# EasyEDA Pro project ProPrj_STC电磁2.0挖孔.epro, board PCB1
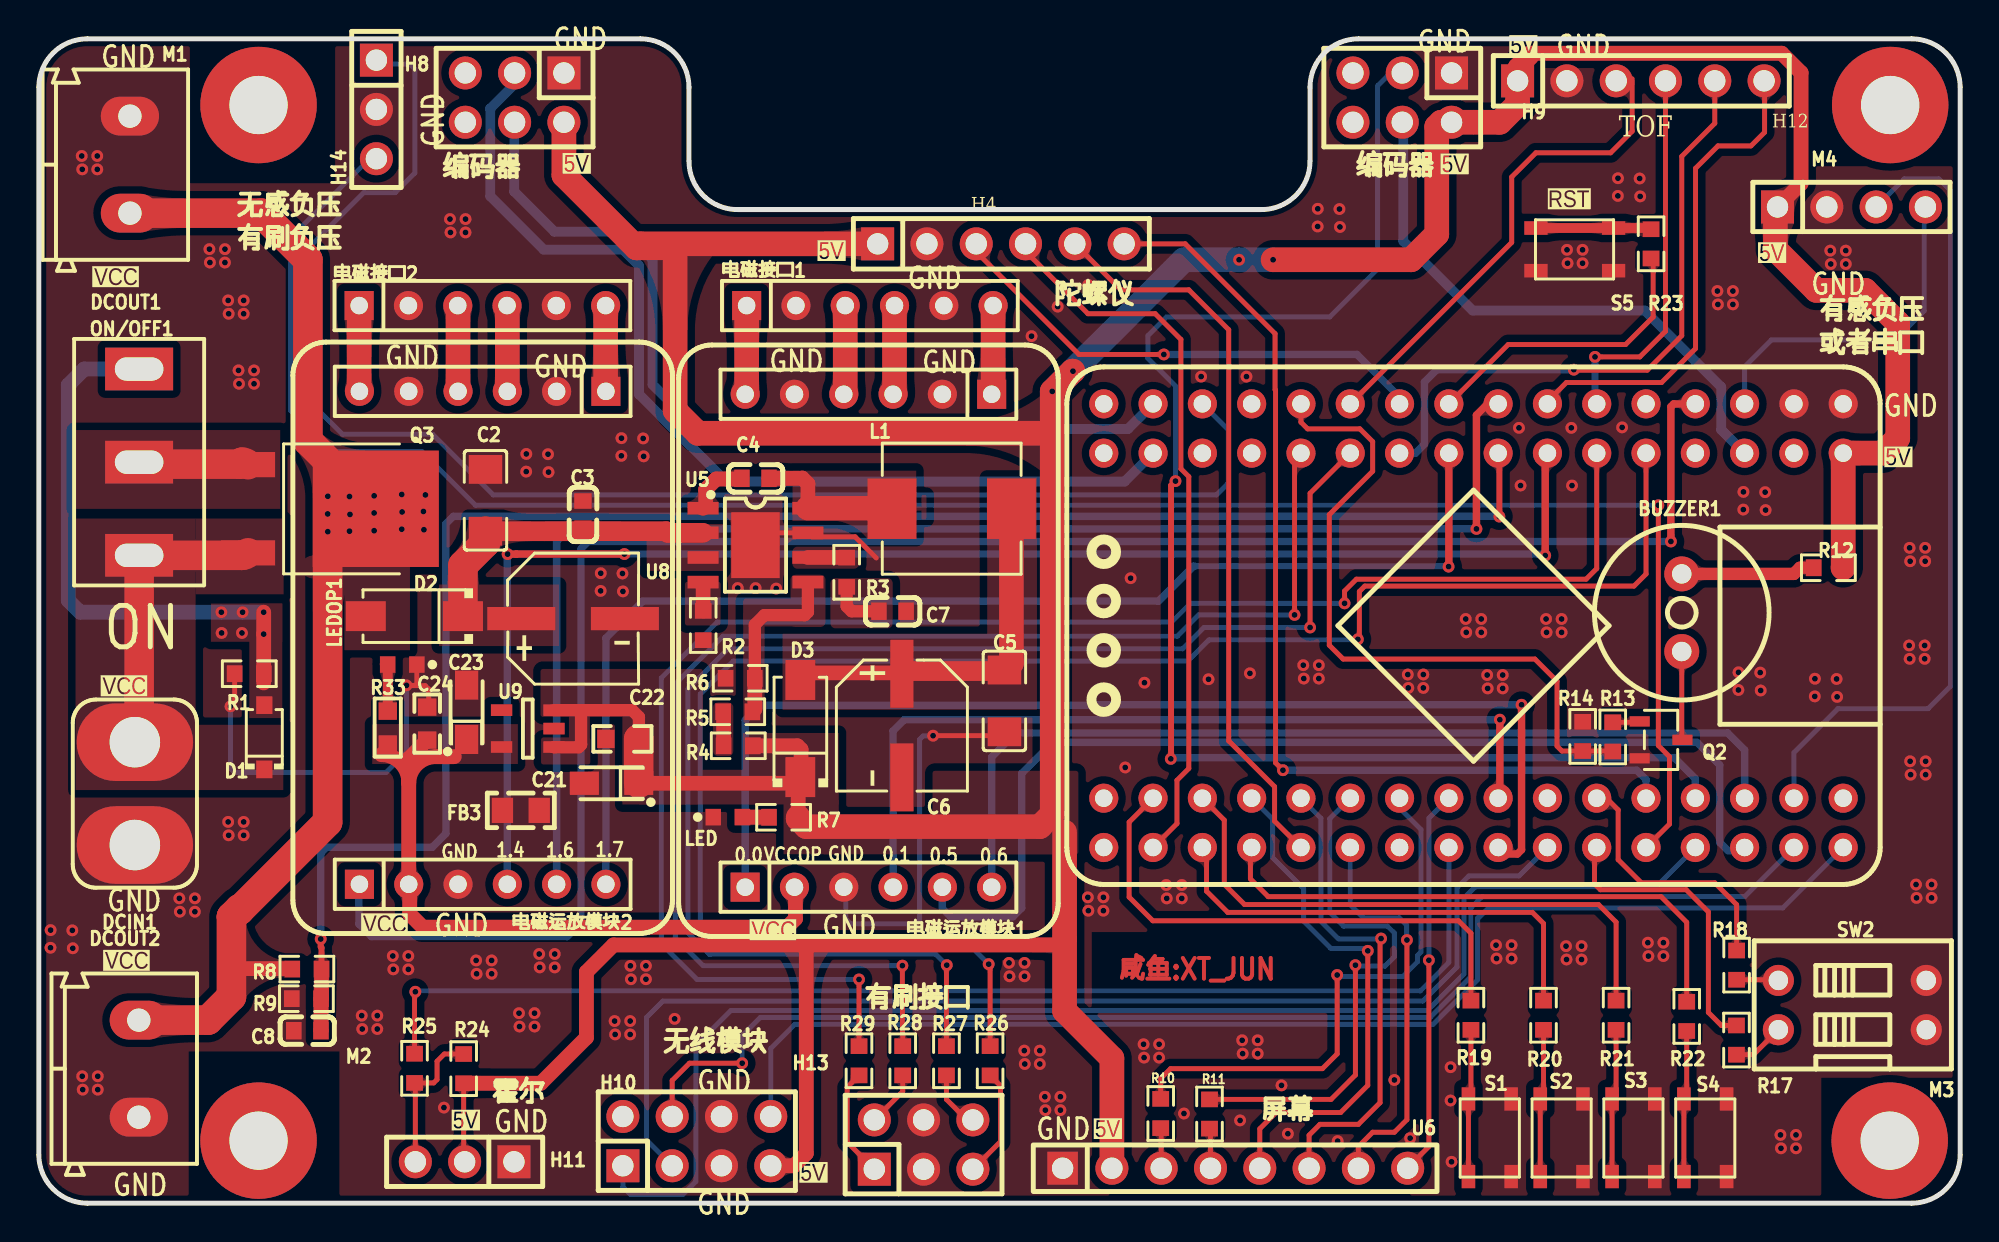
[diagram p2: board, top side]
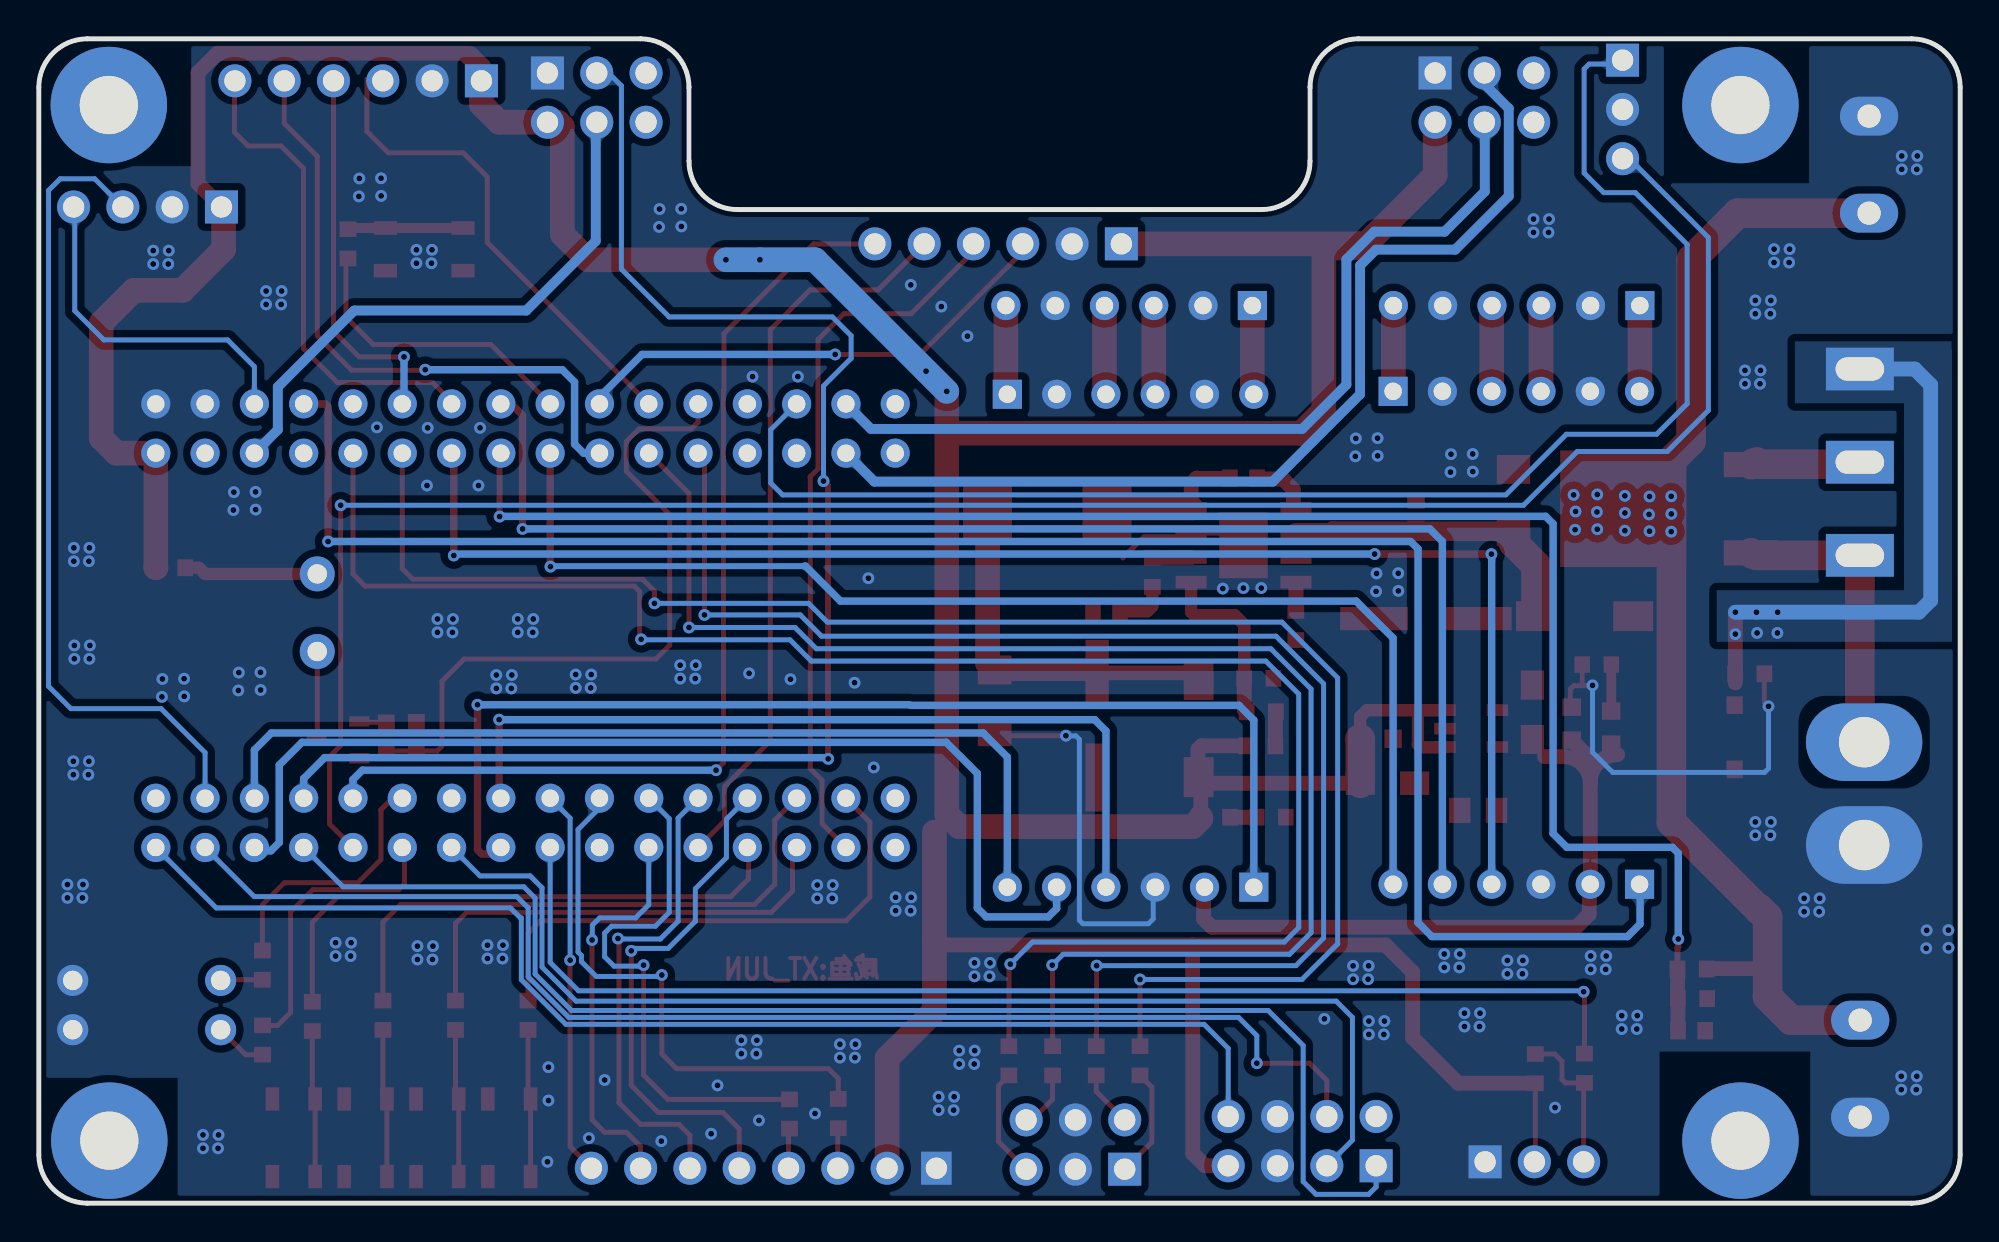
[diagram p3: board, bottom side, seen from below]

Outline 99 x 60 mm; copper layers: Top Layer, Bottom Layer. Coordinates in mm from the lower left corner of the outline.
Outline path: 0,57.5 0,2.5 arc(0.73,0.73) 2.5,0 96.5,0 arc(98.27,0.73) 99,2.5 99,57.5 arc(98.27,59.27) 96.5,60 68,60 arc(66.23,59.27) 65.5,57.5 65.5,53.7 arc(64.77,51.93) 63,51.2 36,51.2 arc(34.23,51.93) 33.5,53.7 33.5,57.5 arc(32.77,59.27) 31,60 2.5,60 arc(0.73,59.27) 0,57.5
Stack: Top Layer 0.012mm / Dielectric1 0.025mm FR4 er 4.5 / Bottom Layer 0.012mm

## Design rules (mm)
template: 自定义配置
spacing copperThickness1oz (default): track to track 0.102, other pairs 0.152 to 0.3
spacing copperThickness2oz: track to track 0.203, other pairs 0.152 to 0.3
track width copperThickness1oz (default): min 0.127, default 0.254, max 2.54
track width copperThickness2oz: min 0.203, default 0.254, max 2.54
differential pair differentialPair (default): width min 0.127, default 0.254, max 2.54; gap min 0.152, default 0.152
via viaSize (default): diameter min 0.5, default 0.61, max 10; hole min 0.3, default 0.305, max 6.3
net GND uses copperRegion1

## Placement (name value [footprint] x y rotation side)
BUZZER1  2.7kHz  [BUZ-TH_BD9.0-P4.00-D0.6-FD]  84.65 30.43 270 top
C2  4.7uF  [C1206]  23.01 36.22 270 top
C3  100nF  [C0603]  28.04 35.48 270 top
C4  100nF  [C0603]  36.93 37.35 180 top
C5  47uF  [C1206]  49.75 25.88 90 top
C6  100uF  [CAP-SMD_BD6.3-L6.6-W6.6-LS7.6-FD-1]  44.47 24.61 270 top
C7  4.7nF  [C0603]  43.99 30.5 180 top
C8  100nF  [C0603]  13.84 8.89 0 top
C21  10uF  [CAPT3216]  29.51 21.64 180 top
C22  100nF  [CAPC1608[0603]S-N]  30.07 23.93 0 top
C23  10uF  [CAPT3216]  22.04 25.3 90 top
C24  100nF  [CAPC1608[0603]S-N]  20.01 24.71 270 top
D1  BZT52C16  [SOD-123_L2.7-W1.7-LS3.8-RD]  11.62 24.01 90 top
D2  SS54  [SMA_L4.4-W2.8-LS5.4-R-RD]  19.35 30.25 180 top
D3  SS54  [SMA_L4.4-W2.8-LS5.4-R-RD]  39.24 24.46 90 top
DCIN1  T型插头  [Wired T-Header ThroughHole]  4.95 21.11 0 top
DCOUT1  KF/WJ/DG 30x connecter  [KF/WJ/DG 301-2p-5.0mm]  4.69 53.52 90 top
DCOUT2  KF/WJ/DG 30x connecter  [KF/WJ/DG 301-2p-5.0mm]  5.15 6.93 90 top
FB3  0R  [INDC2012[0805]S]  24.84 20.24 180 top
H4  PZ254V-11-06P  [HDR-TH_6P-P2.54-V-M]  49.57 49.44 0 top
H5  PZ254V-11-04P  [HDR-TH_4P-P2.54-V-M]  93.4 51.34 0 top
H8  PZ254V-12-6P  [HDR-TH_6P-P2.54-V-M-R2-C3-S2.54]  24.52 56.97 180 top
H9  PZ254V-12-6P  [HDR-TH_6P-P2.54-V-M-R2-C3-S2.54]  70.25 56.97 180 top
H10  PZ254V-12-8P  [HDR-TH_8P-P2.54-V-M-R2-C4-S2.54]  33.9 3.2 0 top
H11  PZ254V-11-03P  [HDR-TH_3P-P2.54-V-M]  21.94 2.13 180 top
H12  PZ254V-11-06P  [HDR-TH_6P-P2.54-V-M]  82.55 57.83 0 top
H13  PZ254V-12-6P  [HDR-TH_6P-P2.54-V-M-R2-C3-S2.54]  45.59 3.02 0 top
H14  PZ254V-11-03P  [HDR-TH_3P-P2.54-V-M]  17.39 56.36 270 top
L1  4.7uH  [IND-SMD_L7.3-W6.6_MHCI06030]  47.04 35.79 0 top
LED  LED  [LEDC1608(0603)]  35.5 19.89 0 top
LEDOP1  LEDOP  [LEDC1608(0603)]  18.73 27.75 180 top
M1  MountHole  [M3-MountHole-Plated-D6]  11.32 56.59 0 top
M2  MountHole  [M3-MountHole-Plated-D6]  11.32 3.22 0 top
M3  MountHole  [M3-MountHole-Plated-D6]  95.37 3.22 0 top
M4  MountHole  [M3-MountHole-Plated-D6]  95.39 56.59 0 top
ON/OFF1  SW-SPDT  [SS12D10]  5.17 38.18 90 top
Q2  S8050 J3Y  [SOT-23-3_L3.0-W1.7-P0.95-LS2.9-BR]  83.59 23.87 180 top
Q3  HY19P03D  [TO-252-2_L6.6-W6.1-P4.57-LS9.9-TL-CW]  14.07 35.78 0 top
R1  10kΩ  [R0603]  10.84 27.28 0 top
R2  200kΩ  [R0603]  34.24 29.77 90 top
R3  20kΩ  [R0603]  41.63 32.51 90 top
R4  51kΩ  [R0603]  36.04 23.57 0 top
R5  1.5kΩ  [R0603]  36.01 25.32 180 top
R6  10kΩ  [R0603]  36.14 27.05 0 top
R7  4.7kΩ  [R0603]  38.38 19.89 0 top
R8  200kΩ  [R0603]  13.81 12.06 180 top
R9  20kΩ  [R0603]  13.79 10.54 180 top
R10  100Ω  [R0603]  57.81 4.62 90 top
R11  100Ω  [R0603]  60.32 4.6 90 top
R12  10Ω  [R0603]  92.21 32.74 180 top
R13  4.7kΩ  [R0603]  81.1 24.03 90 top
R14  10kΩ  [R0603]  79.55 24.05 90 top
R17  100Ω  [R0603]  87.47 8.41 270 top
R18  100Ω  [R0603]  87.48 12.27 270 top
R19  100Ω  [R0603]  73.79 9.68 270 top
R20  100Ω  [R0603]  77.53 9.68 270 top
R21  100Ω  [R0603]  81.27 9.68 270 top
R22  100Ω  [R0603]  84.91 9.63 270 top
R23  100Ω  [R0603]  83.07 49.44 90 top
R24  10kΩ  [R0603]  21.89 6.93 270 top
R25  100Ω  [R0603]  19.36 6.95 270 top
R26  100Ω  [R0603]  49.02 7.34 90 top
R27  100Ω  [R0603]  46.77 7.34 270 top
R28  100Ω  [R0603]  44.51 7.34 270 top
R29  100Ω  [R0603]  42.26 7.34 270 top
R33  4.7K  [RESC1608[0603]S-N]  17.98 24.51 270 top
S1  Button  [PTS810-3*4-CurvePin]  74.76 3.37 90 top
S2  Button  [PTS810-3*4-CurvePin]  78.46 3.37 90 top
S3  Button  [PTS810-3*4-CurvePin]  82.16 3.37 90 top
S4  Button  [PTS810-3*4-CurvePin]  85.86 3.37 90 top
S5  Button  [PTS810-3*4-CurvePin]  79.14 49.15 0 top
SW2  DS-02RP  [SW-TH_DS-02XP]  93.44 10.21 90 top
U1  -  [STC32]  73.92 29.76 270 top
U5  -  [SP1N28STER]  36.93 33.91 0 top
U6  PM254-1-08-Z-8.5  [HDR-TH_8P-P2.54-V-F]  61.64 1.8 0 top
U8  100uF  [CAP-SMD_BD6.3-L6.6-W6.6-LS7.6-RD]  27.53 30.12 0 top
U9  RT9013-33  [SOT-23-5]  25.2 24.46 180 top
电磁接口1  Header 6  [HDR1X6]  36.47 46.25 0 top
电磁接口2  Header 6  [HDR1X6]  16.51 46.25 0 top
电磁运放模块1  OPA_MOD  [SEEKFREE_4CHANEL_OPAMOD]  42.75 28.98 0 top
电磁运放模块2  OPA_MOD  [SEEKFREE_4CHANEL_OPAMOD]  22.87 29.13 0 top

## Footprints (pads in the part's own frame, mm; a bottom-side part is the same pattern mirrored in y, then rotated)
BUZ-TH_BD9.0-P4.00-D0.6-FD
  round 1.8 hole 1: 1(-2,0) 2(2,0)
C0603
  rect 0.8x0.9 smd: 1(-0.7,0) 2(0.7,0)
C1206
  rect 1.485x1.728 smd: 1(-1.593,0) 2(1.593,0)
CAP-SMD_BD6.3-L6.6-W6.6-LS7.6-FD-1
  rect 3.5x1.2 smd: 1(-2.67,0) 2(2.67,0)
CAP-SMD_BD6.3-L6.6-W6.6-LS7.6-RD
  rect 3.5x1.2 smd: 1(-2.67,0) 2(2.67,0)
CAPC1608[0603]S-N
  rect 0.9x0.95 smd: 1(-0.85,0) 2(0.85,0)
CAPT3216
  rect 1.5x1.2 smd: 1(-1.4,0) 2(1.4,0)
HDR1X6
  rect 1.5x1.5 hole 0.9: 1(0,0)
  round 1.5 hole 0.9: 2(2.54,0) 3(5.08,0) 4(7.62,0) 5(10.16,0) 6(12.7,0)
HDR-TH_3P-P2.54-V-M
  rect 1.7x1.7 hole 1.1: 1(-2.54,0)
  round 1.7 hole 1.1: 2(0,0) 3(2.54,0)
HDR-TH_4P-P2.54-V-M
  rect 1.7x1.7 hole 1.1: 1(-3.81,0)
  round 1.7 hole 1.1: 2(-1.27,0) 3(1.27,0) 4(3.81,0)
HDR-TH_6P-P2.54-V-M
  rect 1.7x1.7 hole 1.1: 1(-6.35,0)
  round 1.7 hole 1.1: 2(-3.81,0) 3(-1.27,0) 4(1.27,0) 5(3.81,0) 6(6.35,0)
HDR-TH_6P-P2.54-V-M-R2-C3-S2.54
  rect 1.7x1.7 hole 1.1: 1(-2.54,-1.27)
  round 1.7 hole 1.1: 2(-2.54,1.27) 3(0,-1.27) 4(0,1.27) 5(2.54,-1.27) 6(2.54,1.27)
HDR-TH_8P-P2.54-V-F
  rect 1.575x1.7 hole 1.1: 1(-8.89,0)
  round 1.7 hole 1.1: 2(-6.35,0) 3(-3.81,0) 4(-1.27,0) 5(1.27,0) 6(3.81,0) 7(6.35,0) 8(8.89,0)
HDR-TH_8P-P2.54-V-M-R2-C4-S2.54
  rect 1.7x1.7 hole 1.1: 1(-3.81,-1.27)
  round 1.7 hole 1.1: 2(-3.81,1.27) 3(-1.27,-1.27) 4(-1.27,1.27) 5(1.27,-1.27) 6(1.27,1.27) 7(3.81,-1.27) 8(3.81,1.27)
IND-SMD_L7.3-W6.6_MHCI06030
  rect 2.524x3.12 smd: 1(-3.078,0) 2(3.078,0)
INDC2012[0805]S
  rect 1.1x1.3 smd: 1(-0.948,0) 2(0.948,0)
KF/WJ/DG 301-2p-5.0mm
  oval 2x3 hole 1.2: 1(2.5,0) 2(-2.5,0)
LEDC1608(0603)
  rect 0.8x0.85 smd: A(0.75,0) C(-0.75,0)
M3-MountHole-Plated-D6
  round 6 hole 3: 1(0,0)
PTS810-3*4-CurvePin
  rect 1.2x0.7 smd: 1(-2,-1.1) 1(2,-1.1) 2(-2,1.1) 2(2,1.1)
R0603
  rect 0.806x0.864 smd: 1(-0.753,0) 2(0.753,0)
RESC1608[0603]S-N
  rect 0.9x0.95 smd: 1(-0.85,0) 2(0.85,0)
SEEKFREE_4CHANEL_OPAMOD
  rect 1.5x1.5 hole 0.9: 1(6.35,12.7) 7(-6.35,-12.7)
  round 1.5 hole 0.9: 2(3.81,12.7) 3(1.27,12.7) 4(-1.27,12.7) 5(-3.81,12.7) 6(-6.35,12.7) 8(-3.81,-12.7) 9(-1.27,-12.7) 10(1.27,-12.7) 11(3.81,-12.7) 12(6.35,-12.7)
SMA_L4.4-W2.8-LS5.4-R-RD
  rect 2.062x1.539 smd: 1(2.503,0) 2(-2.503,0)
SOD-123_L2.7-W1.7-LS3.8-RD
  rect 0.91x0.84 smd: 1(-1.655,0) 2(1.655,0)
SOT-23-3_L3.0-W1.7-P0.95-LS2.9-BR
  rect 1.038x0.532 smd: 1(1.101,-0.95) 2(1.101,0.95) 3(-1.101,0)
SOT-23-5
  rect 1.1x0.6 smd: 1(-1.35,0.95) 2(-1.35,0) 3(-1.35,-0.95) 4(1.35,-0.95) 5(1.35,0.95)
SP1N28STER
  rect 2.5x3.4 smd: 0(0,0)
  rect 1.6x0.65 smd: 1(-2.7,1.905) 2(-2.7,0.635) 3(-2.7,-0.635) 4(-2.7,-1.905) 5(2.7,-1.905) 6(2.7,-0.635) 7(2.7,0.635) 8(2.7,1.905)
SS12D10
  rect 2.2x3.5 hole 1.2x2.5: 1(-4.8,0) 2(0,0) 3(4.8,0)
STC32
  round 1.5 hole 0.9: 1(-11.43,19.05) 2(-8.89,19.05) 3(-11.43,16.51) 4(-8.89,16.51) 5(-11.43,13.97) 6(-8.89,13.97) 7(-11.43,11.43) 8(-8.89,11.43) 9(-11.43,8.89) 10(-8.89,8.89) 11(-11.43,6.35) 12(-8.89,6.35) 13(-11.43,3.81) 14(-8.89,3.81) 15(-11.43,1.27) 16(-8.89,1.27) 17(-11.43,-1.27) 18(-8.89,-1.27) 19(-11.43,-3.81) 20(-8.89,-3.81) 21(-11.43,-6.35) 22(-8.89,-6.35) 23(-11.43,-8.89) 24(-8.89,-8.89) 25(-11.43,-11.43) 26(-8.89,-11.43) 27(-11.43,-13.97) 28(-8.89,-13.97) 29(-11.43,-16.51) 30(-8.89,-16.51) 31(-11.43,-19.05) 32(-8.89,-19.05) 33(8.89,-19.05) 34(11.43,-19.05) 35(8.89,-16.51) 36(11.43,-16.51) 37(8.89,-13.97) 38(11.43,-13.97) 39(8.89,-11.43) 40(11.43,-11.43) 41(8.89,-8.89) 42(11.43,-8.89) 43(8.89,-6.35) 44(11.43,-6.35) 45(8.89,-3.81) 46(11.43,-3.81) 47(8.89,-1.27) 48(11.43,-1.27) 49(8.89,1.27) 50(11.43,1.27) 51(8.89,3.81) 52(11.43,3.81) 53(8.89,6.35) 54(11.43,6.35) 55(8.89,8.89) 56(11.43,8.89) 57(8.89,11.43) 58(11.43,11.43) 59(8.89,13.97) 60(11.43,13.97) 61(8.89,16.51) 62(11.43,16.51) 63(8.89,19.05) 64(11.43,19.05)
SW-TH_DS-02XP
  round 1.6 hole 1: 1(-1.27,3.81) 2(1.27,3.81) 3(1.27,-3.81) 4(-1.27,-3.81)
TO-252-2_L6.6-W6.1-P4.57-LS9.9-TL-CW
  rect 2.8x1.3 smd: 1(-3.292,2.273) 3(-3.292,-2.273)
  rect 6.5x6 smd: 2(3.292,0)
Wired T-Header ThroughHole
  rrect 6x4 hole 2.6: 1(0,2.65) 2(0,-2.65)

## Nets
As in the schematic.

Pads without a net: H8 5 6; H9 5 6; H10 2; M1 1; M2 1; M3 1; M4 1; U1 4 8 9 25 26 28 31 32 46 63; U9 4

## Via types
v1: diameter 0.61, hole 0.305, Top Layer to Bottom Layer, 279 vias

## Routing (per net, layer and track width the routed paths; a pad name or vN(x,y) marks a point on that pad's centre or on a via; arc(x,y) is an arc through that point)
GND: length 48.3
  Top Layer w0.254: 43.15,33.25 42.06,34.34 39.83,34.34 U5.7 37.56,34.54 U5.0 ; LEDOP1.C 19.48,26.68 v1(18.94,26.68) 18.96,26.67 19.91,26.67 20.09,26.49 20.09,25.64 C24.1 ; v1(9.88,25.6) 10.09,25.82 R1.1 ; v1(46.08,24.09) 49.56,24.09 C5.1
  Bottom Layer w0.254: v1(18.94,26.68) 18.94,23.24 17.9,22.2 10.08,22.2 9.88,22.4 v1(9.88,25.6) ; v1(46.08,24.09) 46.06,24.08 45.56,24.08 45.38,23.9 45.38,14.58 45.2,14.4 41.83,14.4 41.58,14.65 41.58,16.18 电磁运放模块1.9
  vias: v1(0.61,14.07) v1(0.6,13.16) v1(1.73,14.06) v1(1.75,13.14) v1(2.21,53.96) v1(2.24,53.27) v1(2.24,6.54) v1(2.26,5.85) v1(3.01,53.96) v1(3.01,53.27) v1(3.04,6.54) v1(3.04,5.85) v1(7.24,15.71) v1(7.27,15.02) v1(8.04,15.71) v1(8.04,15.02) v1(8.79,49.16) v1(8.82,48.47) v1(9.59,49.16) v1(9.59,48.47) v1(9.76,46.52) v1(9.78,45.83) v1(9.76,19.65) v1(9.78,18.96) v1(10.29,42.91) v1(10.32,42.22) v1(10.56,46.52) v1(10.56,45.83) v1(10.56,19.65) v1(10.56,18.96) v1(11.09,42.91) v1(11.09,42.22) v1(16.64,9.67) v1(16.67,8.98) v1(17.44,9.67) v1(17.44,8.98) v1(18.24,12.74) v1(18.27,12.05) v1(19.04,12.74) v1(19.04,12.05) v1(20.87,4.93) v1(21.19,50.71) v1(21.21,50.02) v1(21.99,50.71) v1(21.99,50.02) v1(22.53,12.51) v1(22.56,11.82) v1(23.33,12.51) v1(23.33,11.82) v1(24.74,9.79) v1(24.77,9.1) v1(25.12,38.61) v1(25.11,37.7) v1(25.54,9.79) v1(25.54,9.1) v1(25.78,12.84) v1(25.81,12.15) v1(26.24,38.6) v1(26.26,37.67) v1(26.58,12.84) v1(26.58,12.15) v1(28.95,32.46) v1(28.95,31.55) v1(29.67,9.39) v1(29.69,8.7) v1(30.02,39.42) v1(30.02,38.51) v1(30.07,32.45) v1(30.1,31.53) v1(30.48,12.23) v1(30.51,11.54) v1(30.47,9.39) v1(30.47,8.7) v1(31.14,39.41) v1(31.16,38.49) v1(31.28,12.23) v1(31.28,11.54) v1(32.76,9.5) v1(36.01,31.7) v1(36.93,31.7) v1(37.99,31.67) v1(49.99,12.38) v1(50.02,11.69) v1(50.79,12.38) v1(50.79,11.69) v1(50.78,7.86) v1(50.8,7.17) v1(51.15,44.68) v1(51.58,7.86) v1(51.58,7.17) v1(51.84,5.48) v1(51.86,4.8) v1(52.5,46.2) v1(52.64,5.48) v1(52.64,4.8) v1(54.07,47.32) v1(54.05,15.76) v1(54.08,15.07) v1(54.85,15.76) v1(54.85,15.07) v1(55.98,22.45) v1(56.26,32.21) v1(56.92,8.19) v1(56.97,26.82) v1(56.95,7.5) v1(57.72,8.19) v1(57.72,7.5) v1(58.09,16.4) v1(58.12,15.71) v1(58.89,16.4) v1(58.89,15.71) v1(59,4.62) v1(59.89,42.59) v1(60.27,27) v1(61.9,4.27) v1(62,8.4) v1(62.03,7.71) v1(62.23,42.59) v1(62.4,27.3) v1(62.8,8.4) v1(62.8,7.71) v1(64.03,6.07) v1(64.36,3.58) v1(65.15,27.72) v1(65.18,27.04) v1(65.9,51.24) v1(65.89,50.33) v1(65.95,27.72) v1(65.95,27.04) v1(66.92,3.2) v1(67.02,51.23) v1(67.04,50.31) v1(69.85,6.35) v1(70.54,27.24) v1(70.56,26.55) v1(70.66,3.35) v1(71.34,27.24) v1(71.34,26.55) v1(72.74,7.01) v1(72.74,5.29) v1(72.79,2.13) v1(73.52,30.1) v1(73.55,29.41) v1(74.32,30.1) v1(74.32,29.41) v1(74.63,27.22) v1(74.65,26.53) v1(75.08,13.3) v1(75.11,12.61) v1(75.43,27.22) v1(75.43,26.53) v1(75.88,13.3) v1(75.88,12.61) v1(76.27,39.95) v1(76.35,36.98) v1(77.66,30.1) v1(77.69,29.41) v1(78.46,30.1) v1(78.46,29.41) v1(78.74,49.13) v1(78.69,13.25) v1(78.72,12.56) v1(78.77,48.44) v1(78.96,39.95) v1(79,36.98) v1(79.54,49.13) v1(79.54,48.44) v1(79.49,13.25) v1(79.49,12.56) v1(81.37,52.82) v1(81.36,51.91) v1(81.58,39.98) v1(82.49,52.8) v1(82.51,51.88) v1(82.91,13.42) v1(82.93,12.73) v1(83.71,13.42) v1(83.71,12.73) v1(86.49,47) v1(86.52,46.31) v1(87.29,47) v1(87.29,46.31) v1(87.58,27.36) v1(87.57,26.45) v1(87.83,36.65) v1(87.83,35.74) v1(88.7,27.34) v1(88.72,26.42) v1(88.95,36.64) v1(88.97,35.72) v1(89.74,3.52) v1(89.77,2.83) v1(90.54,3.52) v1(90.54,2.83) v1(91.52,27.03) v1(91.51,26.12) v1(92.31,49.09) v1(92.33,48.4) v1(92.63,27.01) v1(92.66,26.09) v1(93.11,49.09) v1(93.11,48.4) v1(96.39,33.77) v1(96.42,33.08) v1(96.37,28.74) v1(96.4,28.05) v1(96.42,22.77) v1(96.45,22.08) v1(96.72,16.42) v1(96.75,15.73) v1(97.2,33.77) v1(97.2,33.08) v1(97.17,28.74) v1(97.17,28.05) v1(97.22,22.77) v1(97.22,22.08) v1(97.53,16.42) v1(97.53,15.73)
VBAT: length 61.3
  Top Layer w0.762: R8.2 13.03,12.09 10.44,12.09
  Top Layer w1.524: DCOUT1.2 11.46,51.02 13.86,48.61 13.86,39.28 Q3.2 14.88,33.3 14.88,19.64 10.34,15.1 ; 10.34,15.1 10.34,15.17 9.93,14.76 ; 10.34,15.1 9.93,14.76 ; 9.93,14.76 9.93,10.64 8.72,9.43 DCOUT2.1
  vias: v1(14.89,36.43) v1(14.88,35.52) v1(14.89,34.6) v1(16.01,36.41) v1(16.03,35.49) v1(16.01,34.63) v1(17.28,36.45) v1(17.28,35.57) v1(17.28,34.65) v1(18.7,36.52) v1(18.72,35.62) v1(18.7,34.73) v1(19.82,35.64) v1(19.84,34.7) v1(19.92,36.5)
VCC5V: length 267
  Top Layer w0.254: H11.2 21.89,2.18 R24.2
  Top Layer w0.635: 27.94,25.41 30.57,25.41 30.92,25.06 C22.2 ; 27.94,25.41 U9.3 ; 27.94,25.41 27.94,23.63 27.81,23.49 26.56,23.49 U9.1
  Top Layer w0.762: 39.54,13.31 52.55,13.31 52.85,13.61 ; 39.54,13.31 29.61,13.31 28.22,11.91 28.22,8.53 25.86,6.18 R24.2 ; 39.54,13.31 39.54,2.56 38.91,1.93 H10.7 ; R4.2 39.09,23.57 39.28,23.38 39.28,21.92 ; 76.81,59.13 76.93,59.26 89.8,59.26 90.8,58.25 90.8,52.55 H5.1 ; R7.2 39.13,21.84 ; 38.92,21.64 C21.1
  Top Layer w1.016: 76.81,59.13 76.2,58.52 H12.1
  Top Layer w1.27: H8.2 27.06,52.97 30.8,49.23 ; H4.1 31,49.44 30.8,49.23 ; R7.2 39.13,19.82 39.54,19.4 51.58,19.4 52.22,20.04 v1(52.22,41.83) 53.26,42.87 v1(53.28,42.87) ; 52.85,19.12 52.85,9.9 55.29,7.47 U6.2 ; H12.1 76.2,56.62 75.28,55.7 72.26,55.7 72.03,55.47 72.03,49.93 70.71,48.61 v1(63.6,48.61) ; H5.1 89.48,51.23 89.48,49.15 91.59,47.04 94.1,47.04 95.78,45.36 95.78,39.42 95.01,38.65 U1.2 92.97,32.76 R12.1 ; 30.8,49.23 32.79,49.23 32.79,40.84 33.96,39.67 51.96,39.67
  Top Layer w1.524: C21.1 30.91,23.92 C22.2
  Bottom Layer w1.27: v1(52.22,41.83) 59,48.61 v1(61.84,48.61) v1(63.6,48.61)
VCCOP: length 36.6
  Top Layer w0.762: 电磁运放模块1.8 38.99,16.23 38.99,14.66 38.55,14.22 19.78,14.22 19.11,14.89 19.11,16.38 电磁运放模块2.8 19.06,21.62 arc(19.47,22.6) 20.45,23.01 21.41,23.01 ; C24.2 19.06,22.91 19.06,21.7 arc(18.65,22.7) 17.65,23.11
0.0: length 57.8
  Top Layer w0.381: v1(76.4,25.68) 76.4,18.21 76.18,17.99 75.53,17.99 U1.50
  Bottom Layer w0.381: 电磁运放模块1.7 36.4,24.89 37.16,25.65 54.08,25.65 ; 54.16,25.68 v1(76.4,25.68)
0.1: length 43.6
  Top Layer w0.381: v1(75.28,24.92) 75.28,20.96 U1.49
  Bottom Layer w0.381: 电磁运放模块1.10 44.02,24.33 44.6,24.92 v1(75.28,24.92)
0.2: length 60.6
  Bottom Layer w0.254: U1.52 76.27,16.86 73.68,16.86 73.07,16.25 73.07,12.17 71.32,10.41 32.15,10.41 31.31,9.57 31.31,3.25 H10.3
0.3: length 70.3
  Bottom Layer w0.254: U1.58 83.33,16.31 74.01,16.31 73.43,15.72 73.43,11.81 71.55,9.93 35.66,9.93 33.85,8.13 33.85,1.12 33.19,0.46 30.48,0.46 30.09,0.84 H10.1
0.4: length 74.7
  Top Layer w0.305: v1(58.57,37.21) 58.34,36.98 58.34,22.91 v1(58.33,22.9)
  Bottom Layer w0.254: v1(58.57,37.21) 58.57,42.11 57.15,43.53 57.15,44.7 58.11,45.67 66.52,45.67 68.98,48.13 68.98,57.58 69.64,58.24 69.72,58.24
  Bottom Layer w0.381: v1(58.33,22.9) 58.39,22.96 84.27,22.96 85.35,21.88 U1.57
0.5: length 55.1
  Bottom Layer w0.381: 电磁运放模块1.11 46.56,15.19 46.99,14.76 50.19,14.76 50.64,15.21 50.64,22.15 52.24,23.75 85.44,23.75 86.61,22.58 86.61,18.59 87.04,18.16 87.72,18.16 U1.60
0.6: length 48.9
  Bottom Layer w0.381: U1.59 87.89,23.35 87.02,24.23 50.34,24.23 49.1,22.99 电磁运放模块1.12
0.7: length 67.6
  Top Layer w0.254: v1(36.24,7.21) 33.53,7.21 32.63,6.32 H10.4
  Bottom Layer w0.254: v1(36.24,7.21) 36.24,8.63 37.18,9.57 71.69,9.57 73.78,11.66 73.78,15.24 73.81,15.24 74.37,15.8 87.9,15.8 U1.62
1.0: length 42.1
  Bottom Layer w0.254: H5.3 96.12,52.79 97.9,52.79 98.5,52.19 98.5,26.63 97.35,25.48 92.7,25.48 90.43,23.22 U1.61
1.1: length 17.9
  Bottom Layer w0.254: 97.43,51.34 97.4,51.34 97.15,51.08 97.15,45.98 95.65,44.48 89.27,44.48 87.89,43.1 U1.5
1.3: length 97.9
  Top Layer w0.381: v1(84.09,34.1) 84.09,41.04 84.23,41.18 85.35,41.18 U1.7
  Bottom Layer w0.381: v1(84.09,34.1) 28.32,34.1 27.94,33.72 27.94,14.46 27.22,13.74 17.14,13.74 16.49,14.38 16.49,16.41 电磁运放模块2.7
1.4: length 75.8
  Top Layer w0.381: U1.14 77.62,38.53 v1(77.62,33.37) ; v1(24.16,33.45) 24.6,33.45 24.61,33.45 v1(30.17,33.45)
  Bottom Layer w0.381: v1(24.16,33.45) 24.14,33.43 电磁运放模块2.10 ; v1(77.62,33.37) 77.54,33.45 v1(30.17,33.45)
1.5: length 89.7
  Top Layer w0.305: R8.1 14.57,13.16 14.52,13.21 v1(14.52,13.61) ; U1.16 75.26,38.59 v1(75.26,35.38)
  Top Layer w0.762: R8.1 14.57,10.56 R9.1 14.54,8.89 C8.2
  Bottom Layer w0.381: v1(75.26,35.38) 75.24,35.39 21.36,35.39 20.98,35.01 20.98,19.05 20.27,18.34 14.83,18.34 14.52,18.03 v1(14.52,13.61)
1.6: length 72.5
  Top Layer w0.381: v1(74.08,34.74) 74.08,40.61 74.65,41.19 U1.15
  Bottom Layer w0.381: 74.07,34.75 27.33,34.75 26.68,34.1 电磁运放模块2.11
1.7: length 63.5
  Top Layer w0.381: U1.18 72.65,32.82 v1(72.64,32.8)
  Bottom Layer w0.305: v1(72.64,32.8) 72.62,32.83 59.55,32.83
  Bottom Layer w0.381: 电磁运放模块2.12 29.22,29.12 31.12,31.03 57.69,31.03 59.49,32.83 59.55,32.83
2.0: length 26.8
  Top Layer w0.254: U6.5 62.91,3.83 63.75,4.67 67.08,4.67 68.48,6.07 v1(68.48,13)
  Bottom Layer w0.254: v1(68.48,13) 68.35,13.13 66.57,13.13 65.17,14.53 65.17,16.2 63.57,17.8 63.57,19.79 U1.39
2.1: length 24.8
  Top Layer w0.254: U6.6 65.45,3.5 66.01,4.06 67.99,4.06 69.11,5.18 69.11,13.59 v1(69.16,13.64)
  Bottom Layer w0.254: U1.41 66.06,19.84 66.06,14.53 66.98,13.61 69.13,13.61 v1(69.16,13.64)
2.2: length 20.5
  Top Layer w0.254: v1(70.49,13.56) 70.49,4.3 69.85,3.66 68.73,3.66 67.99,2.92 U6.7
  Bottom Layer w0.254: U1.44 67.57,15.38 68.25,14.71 70.1,14.71 70.48,14.32 70.48,13.58 v1(70.49,13.56)
2.3: length 27.2
  Top Layer w0.254: v1(67.84,12.27) 67.84,6.6 66.59,5.35 R11.2
  Bottom Layer w0.254: U1.43 66.52,19.81 66.52,14.98 67.23,14.27 69.49,14.27 69.85,13.92 69.85,12.7 69.36,12.22 67.89,12.22 v1(67.84,12.27)
2.5: length 28.2
  Top Layer w0.254: v1(66.9,11.76) 66.9,7.69 66.14,6.93 58.31,6.93 57.81,6.42 R10.2
  Bottom Layer w0.254: v1(66.9,11.76) 66.98,11.68 70.28,11.68 71.04,12.44 71.04,12.76 71.22,12.94 71.22,19.26 70.11,20.36 U1.45
2.6: length 63
  Top Layer w0.254: R25.1 19.36,10.85 v1(19.4,10.9)
  Bottom Layer w0.254: U1.48 72.65,12.41 71.19,10.95 19.45,10.95 v1(19.4,10.9)
2.7: length 19.9
  Top Layer w0.254: U6.8 70.53,1.83 71.62,2.92 v1(71.62,12.52)
  Bottom Layer w0.254: U1.47 71.62,19.84 v1(71.62,12.52)
3.3: length 76.6
  Bottom Layer w0.254: H14.1 17.6,58.7 19.12,58.7 19.38,58.44 19.38,53.08 18.36,52.07 16.74,52.07 14.07,49.4 14.07,41.2 15.64,39.62 20.29,39.62 23.41,36.5 60.68,36.5 61.29,37.11 61.29,39.86 U1.27
3.4: length 51.8
  Bottom Layer w0.508: U1.30 55.95,37.18 35.42,37.18 30.92,41.68 30.92,48.32 30.11,49.14 26.02,49.14 23.26,51.89 23.26,56.41 25.09,58.24
3.5: length 46.1
  Bottom Layer w0.508: 25.09,55.7 24.5,55.11 24.5,52.13 26.56,50.06 30.19,50.06 31.62,48.63 31.62,42.18 33.91,39.9 56.12,39.9 U1.29
4.0: length 25.7
  Top Layer w0.254: H4.3 48.3,49.03 53.59,43.74 v1(57.97,43.74)
  Bottom Layer w0.381: v1(57.97,43.74) 67.92,43.74 70.11,41.54 U1.19
4.1: length 37.4
  Top Layer w0.254: U1.36 58.64,19.56 58.64,21.79 59.25,22.4 59.25,37.44 58.85,37.84 58.85,44.51 57.52,45.83 54.06,45.83 50.84,49.05 H4.4
4.2: length 38
  Top Layer w0.254: U1.42 63.67,19.69 63.67,21.46 61.31,23.82 61.31,45.01 59.25,47.06 55.75,47.06 H4.5
4.3: length 52.2
  Top Layer w0.254: v1(64.11,22.31) 63.72,22.69 63.72,41.89 63.7,41.92 63.7,44.8 59.07,49.44 H4.6
  Bottom Layer w0.381: v1(64.11,22.31) 82.33,22.31 82.81,21.83 U1.55
4.4: length 25.2
  Top Layer w0.254: H12.6 88.92,57.81 88.92,55.18 88.22,54.48 86.52,54.48 85.37,53.33 85.37,44.04 83.61,42.29 78.71,42.29 77.73,41.31 U1.13
4.5: length 64.9
  Bottom Layer w0.254: U1.64 89.86,15.21 74.7,15.21 74.19,14.71 74.14,14.71 74.14,11.52 71.84,9.22 38.96,9.22 37.71,7.97 H10.8
4.7: length 32.8
  Top Layer w0.254: H12.5 86.36,55.65 84.65,53.94 84.65,44.7 82.88,42.92 79.12,42.92 v1(79.09,42.95)
  Bottom Layer w0.381: v1(79.09,42.95) 72.03,42.95 71.4,42.32 71.4,39.11 70.93,38.65 U1.20
5.3: length 29.8
  Bottom Layer w0.508: U1.6 86.69,39.86 86.69,42.06 82.75,46 73.88,46 70.3,49.58 70.3,55.12 69.72,55.7
6.0: length 90.9
  Top Layer w0.254: v1(48.94,12.32) 49.02,12.24 R26.2 ; v1(67.97,29.06) 68.04,29.13 68.04,31.52 68.32,31.8 82.19,31.8 82.81,32.42 U1.10
  Bottom Layer w0.254: v1(67.97,29.06) 67.94,29.03 60.3,29.03 59.2,27.94 35.78,27.94 34.08,26.24 34.08,14.2 34.82,13.46 47.8,13.46 v1(48.94,12.32)
6.2: length 84.9
  Top Layer w0.254: v1(42.26,11.53) R29.1 ; U1.12 80.27,32.7 79.73,32.16 67.89,32.16 67.28,31.55 v1(67.28,30.91)
  Bottom Layer w0.254: v1(42.26,11.53) 33.91,11.53 32.08,13.37 32.08,27.07 34.95,29.94 58.37,29.94 59.34,30.91 v1(67.28,30.91)
6.3: length 19.5
  Top Layer w0.254: H12.4 83.82,44.93 82.5,43.61 v1(80.18,43.61)
  Bottom Layer w0.381: v1(80.18,43.61) 80.18,41.28 U1.11
6.4: length 74
  Top Layer w0.254: v1(65.5,29.67) 65.5,36.58 U1.22 ; v1(46.78,12.27) 46.77,12.25 R27.1
  Bottom Layer w0.254: v1(65.5,29.67) 60.03,29.67 58.94,28.57 35.52,28.57 33.45,26.5 33.45,13.93 34.56,12.83 46.22,12.83 v1(46.78,12.27)
6.5: length 25
  Top Layer w0.254: 82.1,57.94 82.1,55.24 80.99,54.13 77.14,54.13 75.89,52.88 75.89,49.51 U1.21
6.6: length 71.4
  Top Layer w0.254: R28.1 44.51,8.75 44.5,8.77 v1(44.5,12.24) ; v1(64.7,30.31) 64.7,38.32 U1.24
  Bottom Layer w0.254: v1(44.5,12.24) 34.22,12.24 32.8,13.67 32.8,26.77 35.25,29.22 58.67,29.22 59.76,30.31 v1(64.7,30.31)
6.7: length 35.3
  Top Layer w0.254: U1.23 65.03,40.24 65.38,39.9 68.07,39.9 68.73,39.24 68.73,37.72 66.49,35.48 66.49,28.75 67.2,28.04 77.08,28.04 78.23,26.9 78.23,23.55 78.48,23.3 R14.1 81.07,23.3 81.1,23.27
7.0: length 27.5
  Top Layer w0.254: R19.1 73.79,13.91 73.15,14.55 57.4,14.55 56.18,15.77 56.18,19.64 U1.35
7.1: length 24.4
  Top Layer w0.254: R20.1 77.53,14.41 76.96,14.98 61.26,14.98 60.17,16.08 60.17,18.11 U1.38
7.2: length 29.9
  Top Layer w0.254: R21.1 81.27,14.48 80.36,15.39 62.12,15.39 61.08,16.43 61.08,19.74 U1.37
7.3: length 29.1
  Top Layer w0.254: U1.40 62.43,18.27 62.43,16.71 63.34,15.8 83.59,15.8 84.91,14.48 R22.1
7.5: length 15.3
  Top Layer w0.254: R17.1 86.69,9.16 86.03,9.83 86.03,15.01 84.88,16.15 80.46,16.15 80.16,16.46 80.16,18.21 U1.54
7.6: length 13.3
  Top Layer w0.254: U1.53 80.78,20.87 81.38,20.27 81.38,17.7 82.57,16.51 86.36,16.51 87.48,15.38 R18.1
7.7: length 105.9
  Top Layer w0.254: U1.56 84.02,19.54 84.02,23.01 83.45,23.58 v1(83.45,35.96)
  Bottom Layer w0.254: v1(83.45,35.96) 22.5,35.96 19.73,38.73 15.09,38.73 12.98,40.85 12.98,49.76 17.09,53.87 17.34,53.87 H14.3
RST: length 15.4
  Top Layer w0.254: U1.17 75.71,44.25 81.76,44.25 83.18,45.67 83.18,48.57 R23.1
$1N1706: length 29.1
  Top Layer w0.762: v1(11.59,30.45) v1(11.59,29.32) 11.59,26.81
  Bottom Layer w0.762: v1(11.59,30.45) v1(10.5,30.45) v1(9.41,30.45) 2.13,30.45 1.52,31.06 1.52,42.16 2.34,42.98 ON/OFF1.3
  vias: v1(9.42,29.38) v1(10.47,29.38)
$1N1715: length 14.1
  Top Layer w1.524: 5.17,24.88 ON/OFF1.1 10.47,33.38 arc(10.64,33.42) Q3.3
$1N2398: length 16.1
  Top Layer w1.016: C2.2 32.33,34.63 32.41,34.54 U5.2
  Top Layer w1.524: D2.2 21.85,32.87 23.01,34.03 C2.2
$1N2502: length 1.3
  Top Layer w0.762: 34.23,31.79 34.23,30.53 R2.2
$1N2604: length 3.1
  Top Layer w0.762: U5.1 34.36,35.95 34.36,36.78 34.9,37.32 36.19,37.32 C4.2
$1N2682: length 7.7
  Top Layer w0.762: C4.1 39.33,37.35 39.34,37.36 39.63,37.07 U5.8
  Top Layer w1.27: L1.1 43.93,35.81 U5.8
$1N3128: length 2
  Top Layer w0.762: 41.63,33.26 41.62,33.27 U5.6
$1N3133: length 2.8
  Top Layer w0.635: R3.1 41.63,30.76 41.88,30.5 C7.2
$1N3191: length 18.7
  Top Layer w0.762: C6.1 44.43,27.33 39.6,27.33 D3.1
  Top Layer w1.016: 44.87,27.42 49.7,27.42
  Top Layer w1.27: C5.2 50.11,27.83 L1.2
$1N3383: length 1.8
  Top Layer w0.762: R5.2 35.28,25.3 35.28,23.57
$1N3387: length 9.1
  Top Layer w0.635: U5.5 39.63,30.46 39.47,30.3 37.38,30.3 36.89,29.81 R6.2
  Top Layer w0.762: R5.1 36.89,25.45 R6.2
$1N3546: length 1.4
  Top Layer w0.762: R7.1 36.26,19.89 LED.A
$1N5438: length 2.1
  Top Layer w0.254: U6.3 57.83,3.84 R10.1
$1N5441: length 2.1
  Top Layer w0.254: U6.4 60.37,3.79 R11.1
$1N6146: length 6.9
  Top Layer w0.635: BUZZER1.1 90.43,32.43 90.75,32.74 R12.2
$1N6303: length 1.4
  Top Layer w0.254: R13.2 82.44,24.78 Q2.1
$1N6306: length 4.6
  Top Layer w0.254: BUZZER1.2 84.65,23.91 Q2.3
$1N11511: length 5.7
  Top Layer w1.524: ON/OFF1.2 5.27,38.08 10.37,38.08 10.47,38.18 arc(10.64,38.15) Q3.1
$1N19309: length 2.5
  Top Layer w0.508: R33.1 17.98,27.62 17.82,27.78
$2N739: length 2.7
  Top Layer w0.254: R17.2 88.35,7.65 SW2.1
$2N743: length 2.2
  Top Layer w0.254: R18.2 89.6,11.51 SW2.2
$2N1137: length 7.6
  Top Layer w0.254: S1.2 S1.2 73.79,5.5 R19.2
$2N1140: length 7.6
  Top Layer w0.254: R20.2 77.53,5.54 S2.2 S2.2
$2N1143: length 7.6
  Top Layer w0.254: R21.2 81.27,5.58 S3.2 S3.2
$2N1146: length 7.6
  Top Layer w0.254: S4.2 S4.2 84.91,5.52 R22.2
$2N1149: length 6
  Top Layer w0.508: S5.2 S5.2 83.17,50.25 83.18,50.26
$2N1985: length 7.8
  Top Layer w0.254: R25.2 19.4,6.2 ; 19.4,6.2 19.4,2.13 ; 19.4,6.2 20.34,6.2 20.52,6.37 20.52,7.31 20.89,7.69 R24.1
$2N2479: length 5.7
  Top Layer w0.254: H13.1 41.65,3.15 41.65,5.98 R29.2
$2N2485: length 2.9
  Top Layer w0.254: H13.2 44.51,5.76 R28.2
$2N2491: length 3
  Top Layer w0.254: H13.6 47.82,4.29 46.77,5.35 R27.2
$2N2497: length 5.6
  Top Layer w0.254: H13.5 49.55,3.17 49.55,6.05 R26.1
$2N17069: length 4.6
  Top Layer w1.27: 电磁接口1.6 49.17,41.76 电磁运放模块1.1
$2N17070: length 4.6
  Top Layer w1.27: 电磁运放模块1.6 36.47,41.76 电磁接口1.1
$2N17080: length 4.6
  Top Layer w1.27: 电磁接口1.3 41.55,41.76 电磁运放模块1.4
$2N17081: length 4.6
  Top Layer w1.27: 电磁运放模块1.3 44.09,41.76 电磁接口1.4
$2N17084: length 4.4
  Top Layer w1.27: 电磁运放模块2.1 29.21,41.85 电磁接口2.6
$2N17085: length 4.4
  Top Layer w1.27: 电磁运放模块2.6 16.51,41.85 电磁接口2.1
$2N17095: length 4.4
  Top Layer w1.27: 电磁运放模块2.4 21.6,46.24 电磁接口2.3
$2N17096: length 4.4
  Top Layer w1.27: 电磁接口2.4 24.14,46.24 电磁运放模块2.3

## Copper pours and planes (outline as drawn; the poured copper is in the pictures)
GND on Top Layer: -4.3,62.61 108.2,62.61 108.2,-7.22 -4.3,-7.22
GND on Bottom Layer: -5.49,63.52 107.56,63.52 107.56,-5.74 -5.49,-5.74
VBAT on Top Layer: 15.74,33.15 19.12,33.15 19.12,28.5 15.74,28.5
VCC5V on Top Layer: 30.91,22.33 36.99,22.33 36.99,20.55 30.91,20.55
VCC5V on Top Layer: 40.36,19.89 53.31,19.89 53.31,17.98 40.36,17.98
VCC5V on Top Layer: 30.07,25.66 34.21,25.66 34.21,20.55 30.07,20.55
VCC5V on Top Layer: 27.31,25.41 28.39,25.41 28.39,23.21 27.31,23.21
VCC5V on Top Layer: 38.38,20.78 41.22,20.78 41.22,17.98 38.38,17.98
VCC5V on Top Layer: 25.85,27.53 34.21,27.53 34.21,25.06 25.85,25.06
VCC5V on Top Layer: 25.88,24 28.42,24 28.42,22.6 25.88,22.6
VCC5V on Top Layer: 36.27,24.23 41.22,24.23 41.22,20.55 36.27,20.55
VCC5V on Top Layer: 46.05,22.28 53.56,22.28 53.56,17.98 46.05,17.98
VCCOP on Top Layer: 17.18,24.69 24.68,24.69 24.68,22.63 17.18,22.63
$1N1706 on Top Layer: 10.84,30.9 12.55,30.9 12.55,25 10.84,25
$1N1706 on Top Layer: 8.87,30.9 12.55,30.9 12.55,28.93 8.87,28.93
$1N1706 on Bottom Layer: 0.42,44.03 2.89,44.03 2.89,31.46 0.42,31.46
$1N1706 on Bottom Layer: 0.44,44.41 8.52,44.41 8.52,41.22 0.44,41.22
$1N1706 on Bottom Layer: 0.42,31.58 12.55,31.58 12.55,28.93 0.42,28.93
$1N1715 on Top Layer: 8.08,35.28 12.61,35.28 12.61,31.38 8.08,31.38
$1N1715 on Top Layer: 7.24,24.65 12.6,24.65 12.6,21.29 7.24,21.29
$1N1715 on Top Layer: 1.89,35.28 8.08,35.28 8.08,21.29 1.89,21.29
$1N2398 on Top Layer: 31.32,35 35.26,35 35.26,32.58 31.32,32.58
$1N2398 on Top Layer: 20.62,31.88 26.8,31.88 26.8,28.71 20.62,28.71
$1N2502 on Top Layer: 33.29,32.02 35.13,32.02 35.13,29.77 33.29,29.77
$1N2682 on Top Layer: 38.71,36.5 45.74,36.5 45.74,35.23 38.71,35.23
$1N2682 on Top Layer: 38.83,37.75 45.21,37.75 45.21,35.15 38.83,35.15
$1N3128 on Top Layer: 38.83,33.83 42.26,33.83 42.26,32.69 38.83,32.69
$1N3133 on Top Layer: 40.79,32.21 44,32.21 44,29.62 40.79,29.62
$1N3191 on Top Layer: 38.32,29.34 51.43,29.34 51.43,25.42 38.32,25.42
$1N3191 on Top Layer: 48.87,37.39 51.43,37.39 51.43,28.11 48.87,28.11
$1N3383 on Top Layer: 34.74,25.8 35.78,25.8 35.78,23.04 34.74,23.04
$1N3387 on Top Layer: 36.29,30.58 37.4,30.58 37.4,24.67 36.29,24.67
$1N3387 on Top Layer: 36.29,31.15 40.31,31.15 40.31,29.72 36.29,29.72
$1N3387 on Top Layer: 38.73,32.38 40.53,32.38 40.53,29.69 38.73,29.69
$1N11511 on Top Layer: 1.82,39.84 12.44,39.84 12.44,35.78 1.82,35.78

Small or netless copper shapes (teardrops, artwork), in the pictures only: 241 on Top Layer, 80 on Bottom Layer

## Text on the board
Top Layer: 咸鱼:XT_JUN
Top Solder Mask Layer: 咸鱼:XT_JUN
Top Silkscreen Layer: GND | 1.4 | 1.6 | 1.7 | 0.0 | VCCOP | 0.1 | 0.5 | 0.6 | ON | 5V | VCC | RST | 无感负压 / 有刷负压 | 编码器 | 霍尔 | 无线模块 | 有刷接口 | 陀螺仪 | 屏幕 | TOF | 有感负压 / 或者串口
